# Altium schematic sheet CLK.SchDoc
size A3
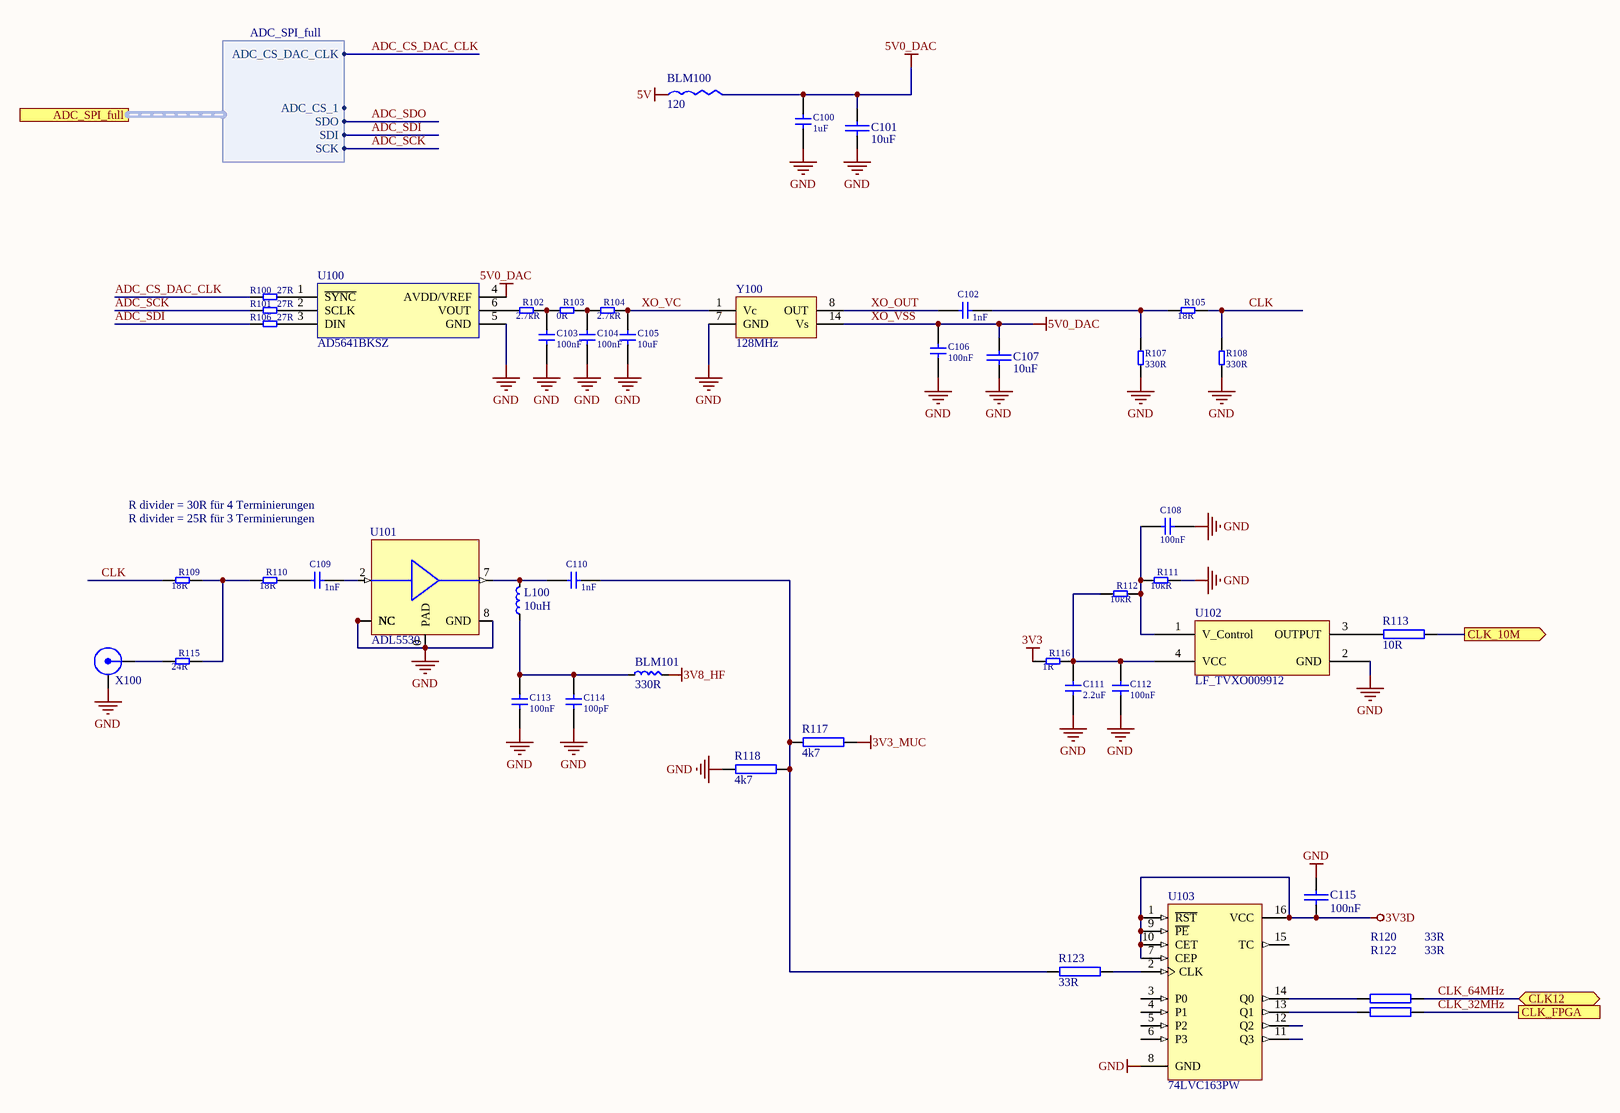
[diagram p0: CLK.SchDoc]

## Parts
BLM100  FerriteBeat  [BLM18SG121TN1]  (value not drawn)
BLM101  330R  [L_0805]
C100  value 1uF  [C_SMD_0603]  (hidden comment: SMD capacitor)
C101  10uF  [0603R]
C102  value 1nF  [C_SMD_0402]  (hidden comment: SMD capacitor)
C103  value 100nF  [C_SMD_0603]  (hidden comment: SMD capacitor)
C104  value 100nF  [C_SMD_0603]  (hidden comment: SMD capacitor)
C105  value 10uF  [C_SMD_1206]  (hidden comment: SMD capacitor)
C106  value 100nF  [C_SMD_0402]  (hidden comment: SMD capacitor)
C107  10uF  [0603R]
C108  value 100nF  [C_SMD_0603]  (hidden comment: SMD capacitor)
C109  value 1nF  [C_SMD_0402]  (hidden comment: SMD capacitor)
C110  value 1nF  [C_SMD_0402]  (hidden comment: SMD capacitor)
C111  value 2.2uF  [C_SMD_0603]  (hidden comment: SMD capacitor)
C112  value 100nF  [C_SMD_0603]  (hidden comment: SMD capacitor)
C113  value 100nF  [C_SMD_0402]  (hidden comment: SMD capacitor)
C114  value 100pF  [C_SMD_0402]  (hidden comment: SMD capacitor)
C115  100nF  [0402RN]
L100  10uH  [WE-MI SMD Multilayer Inductor]
R100  value 27R  [R_SMD_0402]  (hidden comment: SMD Resistor)
R101  value 27R  [R_SMD_0402]  (hidden comment: SMD Resistor)
R102  value 2.7kR  [R_SMD_0402]  (hidden comment: SMD Resistor)
R103  value 0R  [R_SMD_0402]  (hidden comment: SMD Resistor)
R104  value 2.7kR  [R_SMD_0402]  (hidden comment: SMD Resistor)
R105  value 18R  [R_SMD_0402]  (hidden comment: SMD Resistor)
R106  value 27R  [R_SMD_0402]  (hidden comment: SMD Resistor)
R107  value 330R  [R_SMD_0402]  (hidden comment: SMD Resistor)
R108  value 330R  [R_SMD_0402]  (hidden comment: SMD Resistor)
R109  value 18R  [R_SMD_0402]  (hidden comment: SMD Resistor)
R110  value 18R  [R_SMD_0402]  (hidden comment: SMD Resistor)
R111  value 10kR  [R_SMD_0402]  (hidden comment: SMD Resistor)
R112  value 10kR  [R_SMD_0402]  (hidden comment: SMD Resistor)
R113  10R  [0402RN]
R115  value 24R  [R_SMD_0402]  (hidden comment: SMD Resistor)
R116  value 1R  [R_SMD_0402]  (hidden comment: SMD Resistor)
R117  4k7  [0402RN]
R118  4k7  [0402RN]
R120  33R  [0402RN]
R122  33R  [0402RN]
R123  33R  [0402RN]
U100  AD5641BKSZ  [SC70-LT6_L]
U101  ADL5530  [LFCSP_CP-8-1]
U102  LF_TVXO009912  [CFPT-126]
U103  74LVC163PW  [TSSOP-16]
X100  U.FL-R-SMT  [U.FL-R-SMT(01)]  (value not drawn)
Y100  128MHz  [VX7-355S-15]

## Ports
ADC_SPI_full (harness ADC_SPI_full), CLK12 (bidir), CLK_10M (out), CLK_FPGA

## Harnesses
ADC_SPI_full: ADC_CS_1, SDO, SDI, SCK, ADC_CS_DAC_CLK

## Nets
3V3: R116.2
3V3_MUC: R117.2
3V3D: C115.2 U103.1(~{RST}) U103.7(CEP) U103.9(~{PE}) U103.10(CET) U103.16(VCC)
3V8_HF: BLM101.1
5V: BLM100.1
GND: C100.2 C101.2 C103.2 C104.2 C105.2 C106.2 C107.2 C108.2 C111.2 C112.2 C113.2 C114.2 C115.1 R107.2 R108.2 R111.1 R118.1 U100.5(GND) U101.0(PAD) U101.1(NC) U101.3(NC) U101.4(NC) U101.5(NC) U101.6(NC) U101.8(GND) U102.2(GND) U103.8(GND) X100.2 Y100.7(GND)
XO_VSS: BLM100.2 C100.1 C101.1 C106.1 C107.1 U100.4(AVDD/VREF) Y100.14(Vs)  [also labelled 5V0_DAC]
ADC_CS_DAC_CLK: R100.2 ; port ADC_SPI_full.ADC_CS_DAC_CLK
ADC_SCK: R101.2 ; port ADC_SPI_full.SCK
ADC_SDI: R106.2 ; port ADC_SPI_full.SDI
ADC_SDO: port ADC_SPI_full.SDO
CLK: R105.1 R108.1 R109.2
CLK_10M: R113.2 ; port CLK_10M
CLK_32MHz: R122.2 ; port CLK_FPGA
CLK_64MHz: R120.2 ; port CLK12
XO_OUT: C102.1 Y100.8(OUT)
XO_VC: C105.1 R104.1 Y100.1(Vc)
NetBLM101_2: BLM101.2 C113.1 C114.1 L100.2
NetC102_2: C102.2 R105.2 R107.1
NetC103_1: C103.1 R102.1 R103.2
NetC104_1: C104.1 R103.1 R104.2
NetC108_1: C108.1 R111.2 R112.1 U102.1(V_Control)
NetC109_1: C109.1 R110.1
NetC109_2: C109.2 U101.2(IN)
NetC110_1: C110.1 L100.1 U101.7(OUT)
NetC110_2: C110.2 R117.1 R118.2 R123.1
NetC111_1: C111.1 C112.1 R112.2 R116.1 U102.4(VCC)
NetR100_1: R100.1 U100.1(~{SYNC})
NetR101_1: R101.1 U100.2(SCLK)
NetR102_2: R102.2 U100.6(VOUT)
NetR106_1: R106.1 U100.3(DIN)
NetR109_1: R109.1 R110.2 R115.1
NetR113_1: R113.1 U102.3(OUTPUT)
NetR115_2: R115.2 X100.1
NetR120_1: R120.1 U103.14(Q0)
NetR122_1: R122.1 U103.13(Q1)
NetR123_2: R123.2 U103.2(CLK)

Not connected (* = marked no-connect by the designer): U103 3(P0) 4(P1) 5(P2) 6(P3) 11(Q3) 12(Q2) 15(TC)

## Notes on the sheet
- R divider = 30R für 4 Terminierungen
- R divider = 25R für 3 Terminierungen
- (in symbol FerriteBeat) 120

## Library data of the parts
BLM100 = FerriteBeat: BLM18SG121TN1; Link: http://www.murata.com/en-us/api/pdfdownloadapi?cate=luNoiseSupprFilteChipFerriBead&partno=BLM18SG121TN1%23
BLM101 = MPZ2012S331AT000_BLM_330R: MPZ2012S331AT000
C100 = C_SMD: 1uF, 0603, 6.3V, 10%, X5R; Type: X5R; Voltage Rate: *
C101 C107 = 10u, 0603, 16V, X5R, 20%: MLCC, X5R, 16V, 20%, 0603; Libary Name: _CAP.Schlib; Hersteller: Murata; Bauteilenummer: GRM188R61C106MA73D; Bauteilalternative: with same specifications; Typ: Kondensator Keramik MDK; FIT: 2; Eingetragen von: MK; Part Number: 10u, 0603, 16V, X5R, 20%; Footprint Name: 0603R.PcbLib; Footprint: 0603; quantity Multiplier: 1; Source: SN29500-4, Tabelle 1; Distributor1: Digikey; Teilenummer Distributor1: 490-7201-1-ND; Preis @100 Distributor1: 0,1562
C102 C109 C110 = C_SMD: 1nF, 0402, 6.3V, 10%, X5R; Type: X5R; Voltage Rate: *
C103 C104 C108 C112 = C_SMD: 100nF, 0603, 50V, 10%, X5R; Type: X5R; Voltage Rate: *
C105 = C_SMD: 10uF, 1206, 50V, 20%, X5R; Type: X5R; Voltage Rate: *
C106 = C_SMD: 100nF, 0402, 6.3V, 10%, X5R; Type: X5R; Voltage Rate: *
C111 = C_SMD: 2.2uF, 0603, 6.3V, 10%, X5R; Type: X5R; Voltage Rate: *
C113 = C_SMD: 100nF, 0402 50V, 10%, X5R; Type: X5R; Voltage Rate: *
C114 = C_SMD: 100pF, 0402, 50V, 10%, C0G/NP0; Type: X5R; Voltage Rate: *
C115 = 100n, 0402, 50V, X7R: MLCC, X7R, 50V, 10%, 0402; Libary Name: _CAP.Schlib; Bauteilalternative: with same specifications; Part Number: 100n, 0402, 50V, X7R; Footprint Name: 0402RN.PcbLib; Footprint: 0402; quantity Multiplier: 1; Distributor1: Digikey; Preis @100 Distributor1: 0,0054
L100 = 7447908_L_10u: 7447908, WE Inductor
R100 R101 R106 = R_SMD: 27R, 0402, 1%
R102 R104 = R_SMD: 2.7kR, 0402, 1%
R103 = R_SMD: 0R, 0402, 1%
R105 R109 R110 = R_SMD: 18R, 0402, 1%
R107 R108 = R_SMD: 330R, 0402, 1%
R111 R112 = R_SMD: 10kR, 0402, 1%
R113 = 10R, 0402, 1%, 0.063W, 50V: 1%, 0.063W, 50V, 0402; Libary Name: _RES.Schlib; Part Number: 10R, 0402, 1%, 0.063W, 50V; Footprint Name: 0402RN.Pcblib; Footprint: 0402; quantity Multiplier: 1; Distributor1: Digikey; Preis @100 Distributor1: 0,0056
R115 = R_SMD: 24R, 0402, 1%
R116 = R_SMD: 1R, 0402, 1%
R117 R118 = 4k7, 0402, 1%, 0.063W, 50V: 1%, 0.063W, 50V, 0402; Libary Name: _RES.Schlib; Part Number: 4k7, 0402, 1%, 0.063W, 50V; Footprint Name: 0402RN.Pcblib; Footprint: 0402; quantity Multiplier: 1; Distributor1: Digikey; Preis @100 Distributor1: 0,0056
R120 R122 R123 = 33R, 0402, 1%, 0.063W, 50V: 1%, 0.063W, 50V, 0402; Libary Name: _RES.Schlib; Part Number: 33R, 0402, 1%, 0.063W, 50V; Footprint Name: 0402RN.Pcblib; Footprint: 0402; quantity Multiplier: 1; Distributor1: Digikey; Preis @100 Distributor1: 0,0056
U100 = DAC_AD5641BKSZ: DAC, 14bit, +-4LSB INL, SPI, SC70; Libary Name: TI-DAC.Schlib; Eingetragen von: MK; Hersteller: Analog Devices; Typ: IC, ASIC, CMOS, >=50 <=5k Transistoren; DatenblattLink intern: O:\literature\datasheets\analog_devices\ad_da converter\AD5641\AD5641.pdf; FIT: 20; Document SGS: 20150616-A_1D24; Part Number: DAC_AD5641BKSZ; Footprint Name: SC-70.PcbLib; Footprint: SC 70-6; Bauteilenummer: AD5641BKSZ; quantity Multiplier: 1; HelpURL: O:\literature\datasheets\analog_devices\ad_da converter\AD5641\AD5641.pdf; Source: SN29500-2, Tab. 5; Distributor1: digikey; Teilenummer Distributor1: AD5641BKSZ-500RL7CT-ND; Preis @100 Distributor1: 3,4758; Distributor2: Mouser; Teilenummer Distributor2: 584-AD5641BKSZ-500R7; Preis @100 Distributor2: 3,17; Distributor3: Farnell; Teilenummer Distributor3: 2376822; Preis @100 Distributor3: 2,03
U101 = ADL5530: IF Gain Block; DC-1GHz, 3-5 Volt; Libary Name: ANALOG_DEVICES.SchLib; Hersteller: Analog Devices; Bauteilenummer: ADL5530ACPZ-R7; Part Number: ADL5530; Footprint Name: analog_devices.PcbLib; quantity Multiplier: 1; DatenblattLink: http://www.analog.com/media/en/technical-documentation/data-sheets/ADL5530.pdf; Distributor1: Digikey; Teilenummer Distributor1: ADL5530ACPZ-R7CT-ND; Preis @100 Distributor1: 1,93; Distributor2: Mouser; Teilenummer Distributor2: 584-ADL5530ACPZ-R7; Preis @100 Distributor2: 1,66; Distributor3: Farnell; Teilenummer Distributor3: 2727624; Preis @100 Distributor3: 1,66
U103 = Counter - 74LVC163: Synchronous 4-bit binary conter; Libary Name: ON Semi Logic Conter.SchLib; Hersteller: NXP; Bauteilalternative: 74LVC163PW,118; Published: 15-Apr-2002; LatestRevisionDate: 13-Apr-2006; LatestRevisionNote: IPC-7351 Footprint Added.; DatasheetVersion: 9-Apr-1996; PackageVersion: Oct-1999; PackageReference: 751B-05; Publisher: Altium Limited; PackageDescription: 16-Pin Small Outline Integrated Circuit 1.27 mm Pitch; Code_JEDEC: MS-012-AC; Code_IPC: SOIC127P600-16; ComponentLink1Description: Manufacturer Link; ComponentLink1URL: http://www.onsemi.com/; ComponentLink2Description: Datasheet; ComponentLink2URL: http://www.onsemi.com/pub/Collateral/MC74AC161-D.PDF; Part Number: Counter - 74LVC163; Footprint Name: TSSOP-16.Pcblib; Bauteilenummer: 74LVC163PW; quantity Multiplier: 1; HelpURL: http://www.nxp.com/documents/data_sheet/74LVC163.pdf; Distributor1: Digikey; Teilenummer Distributor1: 568-2293-1-ND; Preis @100 Distributor1: 0,383; Distributor2: Mouser; Teilenummer Distributor2: 771-74LVC163PW-T; Preis @100 Distributor2: 0,376; Distributor3: Farnell; Teilenummer Distributor3: 2132711; Preis @100 Distributor3: 0,329
X100 = Connector - U.FL-R-SMT: U.FL Connector U.FL-R-SMT(01), 6GHz, 50R; Libary Name: BNC.Schlib; Hersteller: Hirose; Part Number: Connector - U.FL-R-SMT; Footprint Name: HIROSE_RF.PcbLib; Footprint: U.FL; Bauteilenummer: U.FL-R-SMT(01); quantity Multiplier: 1; HelpURL: http://www.hirose.co.jp/cataloge_hp/e32119372.pdf; DatenblattLink: http://www.hirose.co.jp/cataloge_hp/e32119372.pdf; Distributor3: farnell; Teilenummer Distributor3: 3908021; Preis @100 Distributor3: 0,806
Y100 = VX7-355S-15, 128MHz: VX7-355S-15 128MHz